# Altium schematic sheet driver.SchDoc
size A4
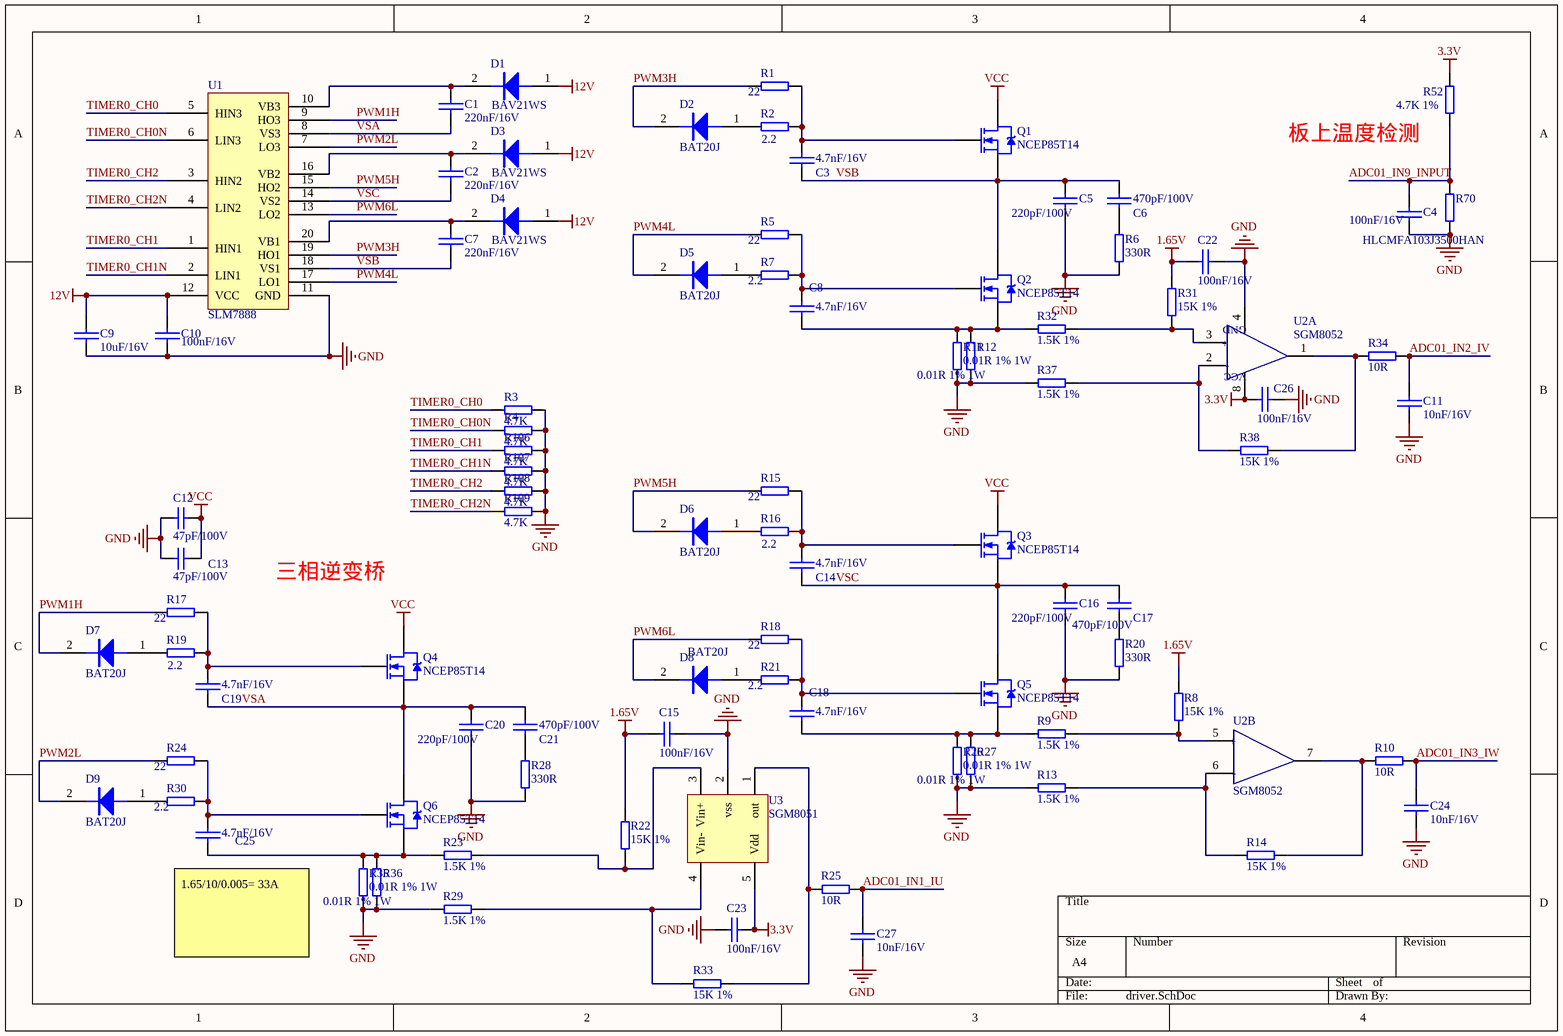
[diagram p0: driver.SchDoc]

## Parts
C1  220nF/16V  [C0402]
C2  220nF/16V  [C0402]
C3  4.7nF/16V  [C0402]
C4  100nF/16V  [C0402]
C5  220pF/100V  [C0805]
C6  470pF/100V  [C0805]
C7  220nF/16V  [C0402]
C8  4.7nF/16V  [C0402]
C9  10uF/16V  [C0805]
C10  100nF/16V  [C0603]
C11  10nF/16V  [C0402]
C12  47pF/100V  [C1206]
C13  47pF/100V  [C1206]
C14  4.7nF/16V  [C0402]
C15  100nF/16V  [C0402]
C16  220pF/100V  [C0805]
C17  470pF/100V  [C0805]
C18  4.7nF/16V  [C0402]
C19  4.7nF/16V  [C0402]
C20  220pF/100V  [C0805]
C21  470pF/100V  [C0805]
C22  100nF/16V  [C0402]
C23  100nF/16V  [C0402]
C24  10nF/16V  [C0402]
C25  4.7nF/16V  [C0402]
C26  100nF/16V  [C0402]
C27  10nF/16V  [C0402]
D1  BAV21WS  [SOD-323]
D2  BAT20J  [SOD-323]
D3  BAV21WS  [SOD-323]
D4  BAV21WS  [SOD-323]
D5  BAT20J  [SOD-323]
D6  BAT20J  [SOD-323]
D7  BAT20J  [SOD-323]
D8  BAT20J  [SOD-323]
D9  BAT20J  [SOD-323]
Q1  NCEP85T14  [TO-220ABN]
Q2  NCEP85T14  [TO-220ABN]
Q3  NCEP85T14  [TO-220ABN]
Q4  NCEP85T14  [TO-220ABN]
Q5  NCEP85T14  [TO-220ABN]
Q6  NCEP85T14  [TO-220ABN]
R1  22  [R0603]
R2  2.2  [R0603]
R3  4.7K  [R0402]
R4  4.7K  [R0402]
R5  22  [R0603]
R6  330R  [R1206]
R7  2.2  [R0603]
R8  15K 1%  [R0402]
R9  1.5K 1%  [R0402]
R10  10R  [R0402]
R11  0.01R 1% 1W  [R1210]
R12  0.01R 1% 1W  [R1210]
R13  1.5K 1%  [R0402]
R14  15K 1%  [R0402]
R15  22  [R0603]
R16  2.2  [R0603]
R17  22  [R0603]
R18  22  [R0603]
R19  2.2  [R0603]
R20  330R  [R1206]
R21  2.2  [R0603]
R22  15K 1%  [R0402]
R23  1.5K 1%  [R0402]
R24  22  [R0603]
R25  10R  [R0402]
R26  0.01R 1% 1W  [R1210]
R27  0.01R 1% 1W  [R1210]
R28  330R  [R1206]
R29  1.5K 1%  [R0402]
R30  2.2  [R0603]
R31  15K 1%  [R0402]
R32  1.5K 1%  [R0402]
R33  15K 1%  [R0402]
R34  10R  [R0402]
R35  0.01R 1% 1W  [R1210]
R36  0.01R 1% 1W  [R1210]
R37  1.5K 1%  [R0402]
R38  15K 1%  [R0402]
R52  4.7K 1%  [R0402]
R70  HLCMFA103J3500HAN  [R0603]
R106  4.7K  [R0402]
R107  4.7K  [R0402]
R108  4.7K  [R0402]
R109  4.7K  [R0402]
U1  SLM7888  [TSSOP-20]
U2  SGM8052  [VSSOP/MSOP-8]  (parts A,B of 2)
U3  SGM8051  [SOT-23(5)]

## Nets
1.65V: C15.2 C22.2 R8.1 R22.1 R31.1
3.3V: C23.2 C26.2 R52.2 U2.8(VCC) U3.5(Vdd)
12V: C9.2 C10.2 D1.1(A) D3.1(A) D4.1(A) U1.12(VCC)
GND: C4.2 C5.1 C9.1 C10.1 C11.2 C12.2 C13.2 C15.1 C16.1 C20.1 C22.1 C23.1 C24.2 C26.1 C27.2 R3.2 R4.2 R6.1 R11.2 R12.2 R13.2 R20.1 R26.2 R27.2 R28.1 R29.2 R35.2 R36.2 R37.2 R70.1 R106.2 R107.2 R108.2 R109.2 U1.11(GND) U2.4(GND) U3.2(vss)
VCC: C12.1 C13.1 Q1.3(D) Q3.3(D) Q4.3(D)
ADC01_IN1_IU: C27.1 R25.1
ADC01_IN2_IV: C11.1 R34.1
ADC01_IN3_IW: C24.1 R10.1
ADC01_IN9_INPUT: C4.1 R52.1 R70.2
PWM1H: D7.2(K) R17.2 U1.9(HO3)
PWM2L: D9.2(K) R24.2 U1.7(LO3)
PWM3H: D2.2(K) R1.2 U1.19(HO1)
PWM4L: D5.2(K) R5.2 U1.17(LO1)
PWM5H: D6.2(K) R15.2 U1.15(HO2)
PWM6L: D8.2(K) R18.2 U1.13(LO2)
TIMER0_CH0: R3.1 U1.5(HIN3)
TIMER0_CH0N: R4.1 U1.6(LIN3)
TIMER0_CH1: R106.1 U1.1(HIN1)
TIMER0_CH1N: R107.1 U1.2(LIN1)
TIMER0_CH2: R108.1 U1.3(HIN2)
TIMER0_CH2N: R109.1 U1.4(LIN2)
VSA: C1.1 C19.2 C20.2 C21.1 Q4.2(S) Q6.3(D) U1.8(VS3)
VSB: C3.2 C5.2 C6.1 C7.1 Q1.2(S) Q2.3(D) U1.18(VS1)
VSC: C2.1 C14.2 C16.2 C17.1 Q3.2(S) Q5.3(D) U1.14(VS2)
NetC1_2: C1.2 D1.2(K) U1.10(VB3)
NetC2_2: C2.2 D3.2(K) U1.16(VB2)
NetC3_1: C3.1 Q1.1(G) R1.1 R2.2
NetC6_2: C6.2 R6.2
NetC7_2: C7.2 D4.2(K) U1.20(VB1)
NetC8_1: C8.1 Q2.1(G) R5.1 R7.2
NetC8_2: C8.2 Q2.2(S) R11.1 R12.1 R32.2
NetC14_1: C14.1 Q3.1(G) R15.1 R16.2
NetC17_2: C17.2 R20.2
NetC18_1: C18.1 Q5.1(G) R18.1 R21.2
NetC18_2: C18.2 Q5.2(S) R9.2 R26.1 R27.1
NetC19_1: C19.1 Q4.1(G) R17.1 R19.2
NetC21_2: C21.2 R28.2
NetC25_1: C25.1 Q6.1(G) R24.1 R30.2
NetC25_2: C25.2 Q6.2(S) R23.2 R35.1 R36.1
NetD2_1: D2.1(A) R2.1
NetD5_1: D5.1(A) R7.1
NetD6_1: D6.1(A) R16.1
NetD7_1: D7.1(A) R19.1
NetD8_1: D8.1(A) R21.1
NetD9_1: D9.1(A) R30.1
NetR8_2: R8.2 R9.1 U2.5(+)
NetR10_2: R10.2 R14.1 U2.7(OUT2)
NetR13_1: R13.1 R14.2 U2.6(-)
NetR22_2: R22.2 R23.1 U3.3(Vin+)
NetR25_2: R25.2 R33.1 U3.1(out)
NetR29_1: R29.1 R33.2 U3.4(Vin-)
NetR31_2: R31.2 R32.1 U2.3(-)
NetR34_2: R34.2 R38.1 U2.1(OUT1)
NetR37_1: R37.1 R38.2 U2.2(-)

## Notes on the sheet
- 板上温度检测
- 三相逆变桥
- (near C25) 1.65/10/0.005= 33A

## Library data of the parts
C1-C11 C14-C27 = CAP: Capacitor
C12 C13 = cap
D1-D9 = DIODE
Q1-Q6 = N-channel Enhancement MOS
R1-R5 R7 R15-R19 R21 R24 R30 R52 R70 R106-R109 = R
R6 R8-R14 R20 R22 R23 R25-R29 R31-R38 = Resistance
U1 = SLM7888: SILLUMIN
U2 = LM393: 圣邦微电子
U3 = LMV7239: 圣邦微电子